# EAGLE design 02_OR (EAGLE 7.5.0)
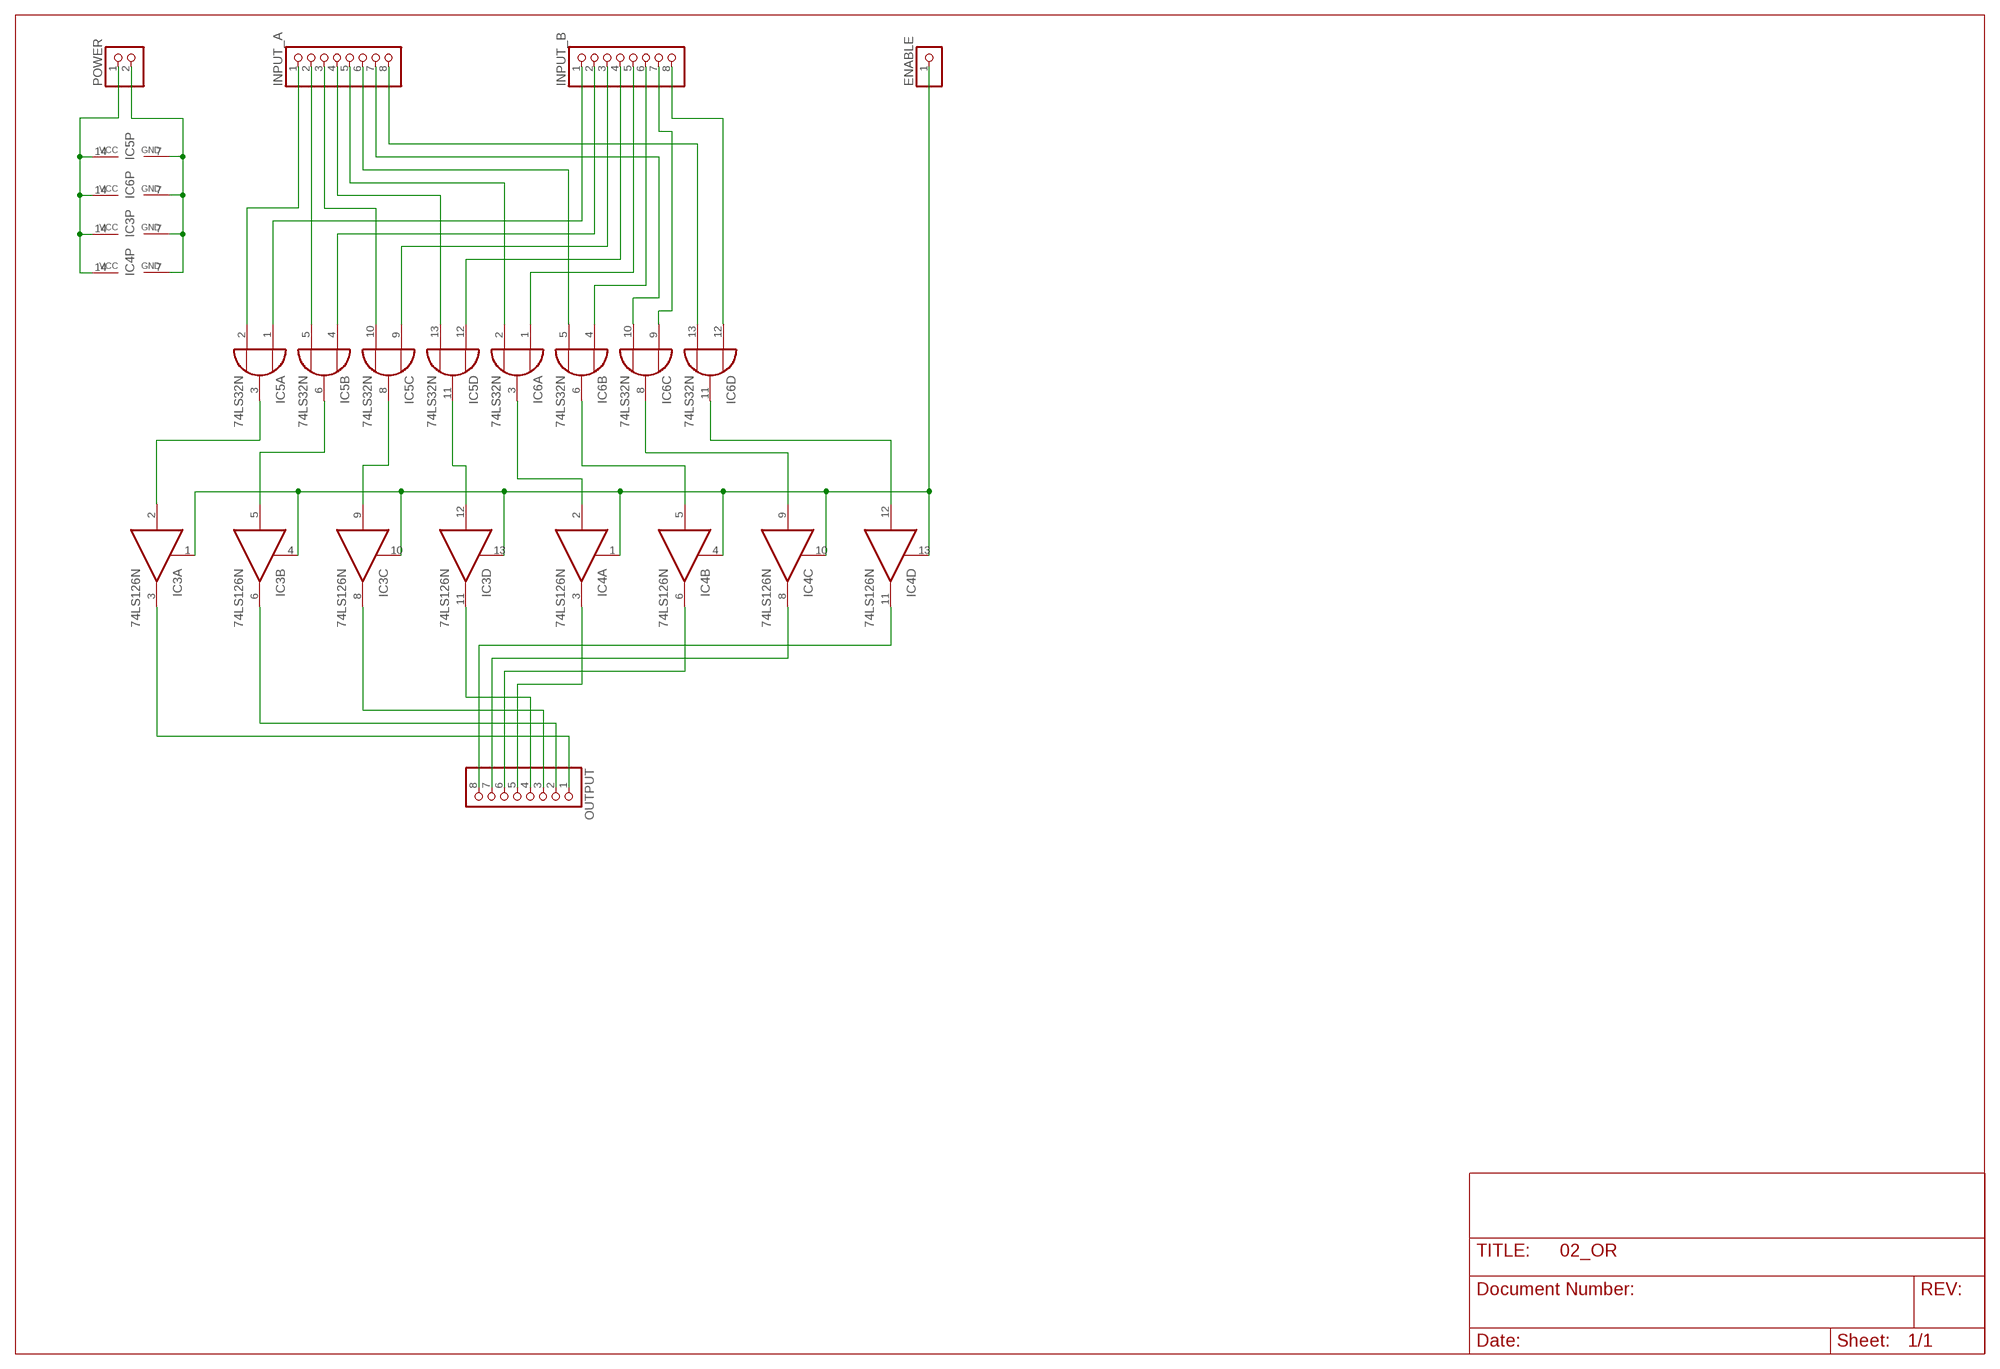
[diagram p0: schematic, sheet 1]

## Parts
ENABLE  PINHD-1X1  [1X01]
IC3  74LS126N  [DIL14]
IC4  74LS126N  [DIL14]
IC5  74LS32N  [DIL14]
IC6  74LS32N  [DIL14]
INPUT_A  PINHD-1X8  [1X08]
INPUT_B  PINHD-1X8  [1X08]
OUTPUT  PINHD-1X8  [1X08]
POWER  PINHD-1X2  [1X02]

## Nets
GND: IC5.7(P:GND) IC6.7(P:GND) POWER.2
N$1: IC5.2(A:I1) INPUT_A.1
N$2: IC5.1(A:I0) INPUT_B.1
N$3: IC5.5(B:I1) INPUT_A.2
N$4: IC5.4(B:I0) INPUT_B.2
N$5: IC5.10(C:I1) INPUT_A.3
N$6: IC5.9(C:I0) INPUT_B.3
N$7: IC5.13(D:I1) INPUT_A.4
N$8: IC5.12(D:I0) INPUT_B.4
N$9: IC6.2(A:I1) INPUT_A.5
N$10: IC6.1(A:I0) INPUT_B.5
N$11: IC6.5(B:I1) INPUT_A.6
N$12: IC6.4(B:I0) INPUT_B.6
N$13: IC6.10(C:I1) INPUT_A.7
N$14: IC6.9(C:I0) INPUT_B.7
N$15: IC6.13(D:I1) INPUT_A.8
N$16: IC6.12(D:I0) INPUT_B.8
N$18: IC3.5(B:I) IC5.6(B:O)
N$19: IC3.9(C:I) IC5.8(C:O)
N$20: IC3.12(D:I) IC5.11(D:O)
N$21: IC4.2(A:I) IC6.3(A:O)
N$22: IC4.5(B:I) IC6.6(B:O)
N$23: IC4.9(C:I) IC6.8(C:O)
N$24: IC4.12(D:I) IC6.11(D:O)
N$25: IC3.3(A:O) OUTPUT.1
N$26: IC3.6(B:O) OUTPUT.2
N$27: IC3.8(C:O) OUTPUT.3
N$28: IC3.11(D:O) OUTPUT.4
N$29: IC4.3(A:O) OUTPUT.5
N$30: IC4.6(B:O) OUTPUT.6
N$31: IC4.8(C:O) OUTPUT.7
N$32: IC4.11(D:O) OUTPUT.8
N$33: ENABLE.1 IC3.1(A:OE) IC3.4(B:OE) IC3.10(C:OE) IC3.13(D:OE) IC4.1(A:OE) IC4.4(B:OE) IC4.10(C:OE) IC4.13(D:OE)
N$34: IC3.2(A:I) IC5.3(A:O)
VCC: IC3.14(P:VCC) IC4.14(P:VCC) IC5.14(P:VCC) IC6.14(P:VCC) POWER.1

## Power pins joined to a net without a drawn wire
GND: IC3.7(P:GND) IC4.7(P:GND)

## Library data of the parts
ENABLE = pinhead:PINHD-1X1: PIN HEADER
IC3 IC4 = 74xx-eu:74*126: Quad bus BUFFER, 3-state
IC5 IC6 = 74xx-eu:74*32: Quad 2-input OR gate
INPUT_A INPUT_B OUTPUT = pinhead:PINHD-1X8: PIN HEADER
POWER = pinhead:PINHD-1X2: PIN HEADER

## Board
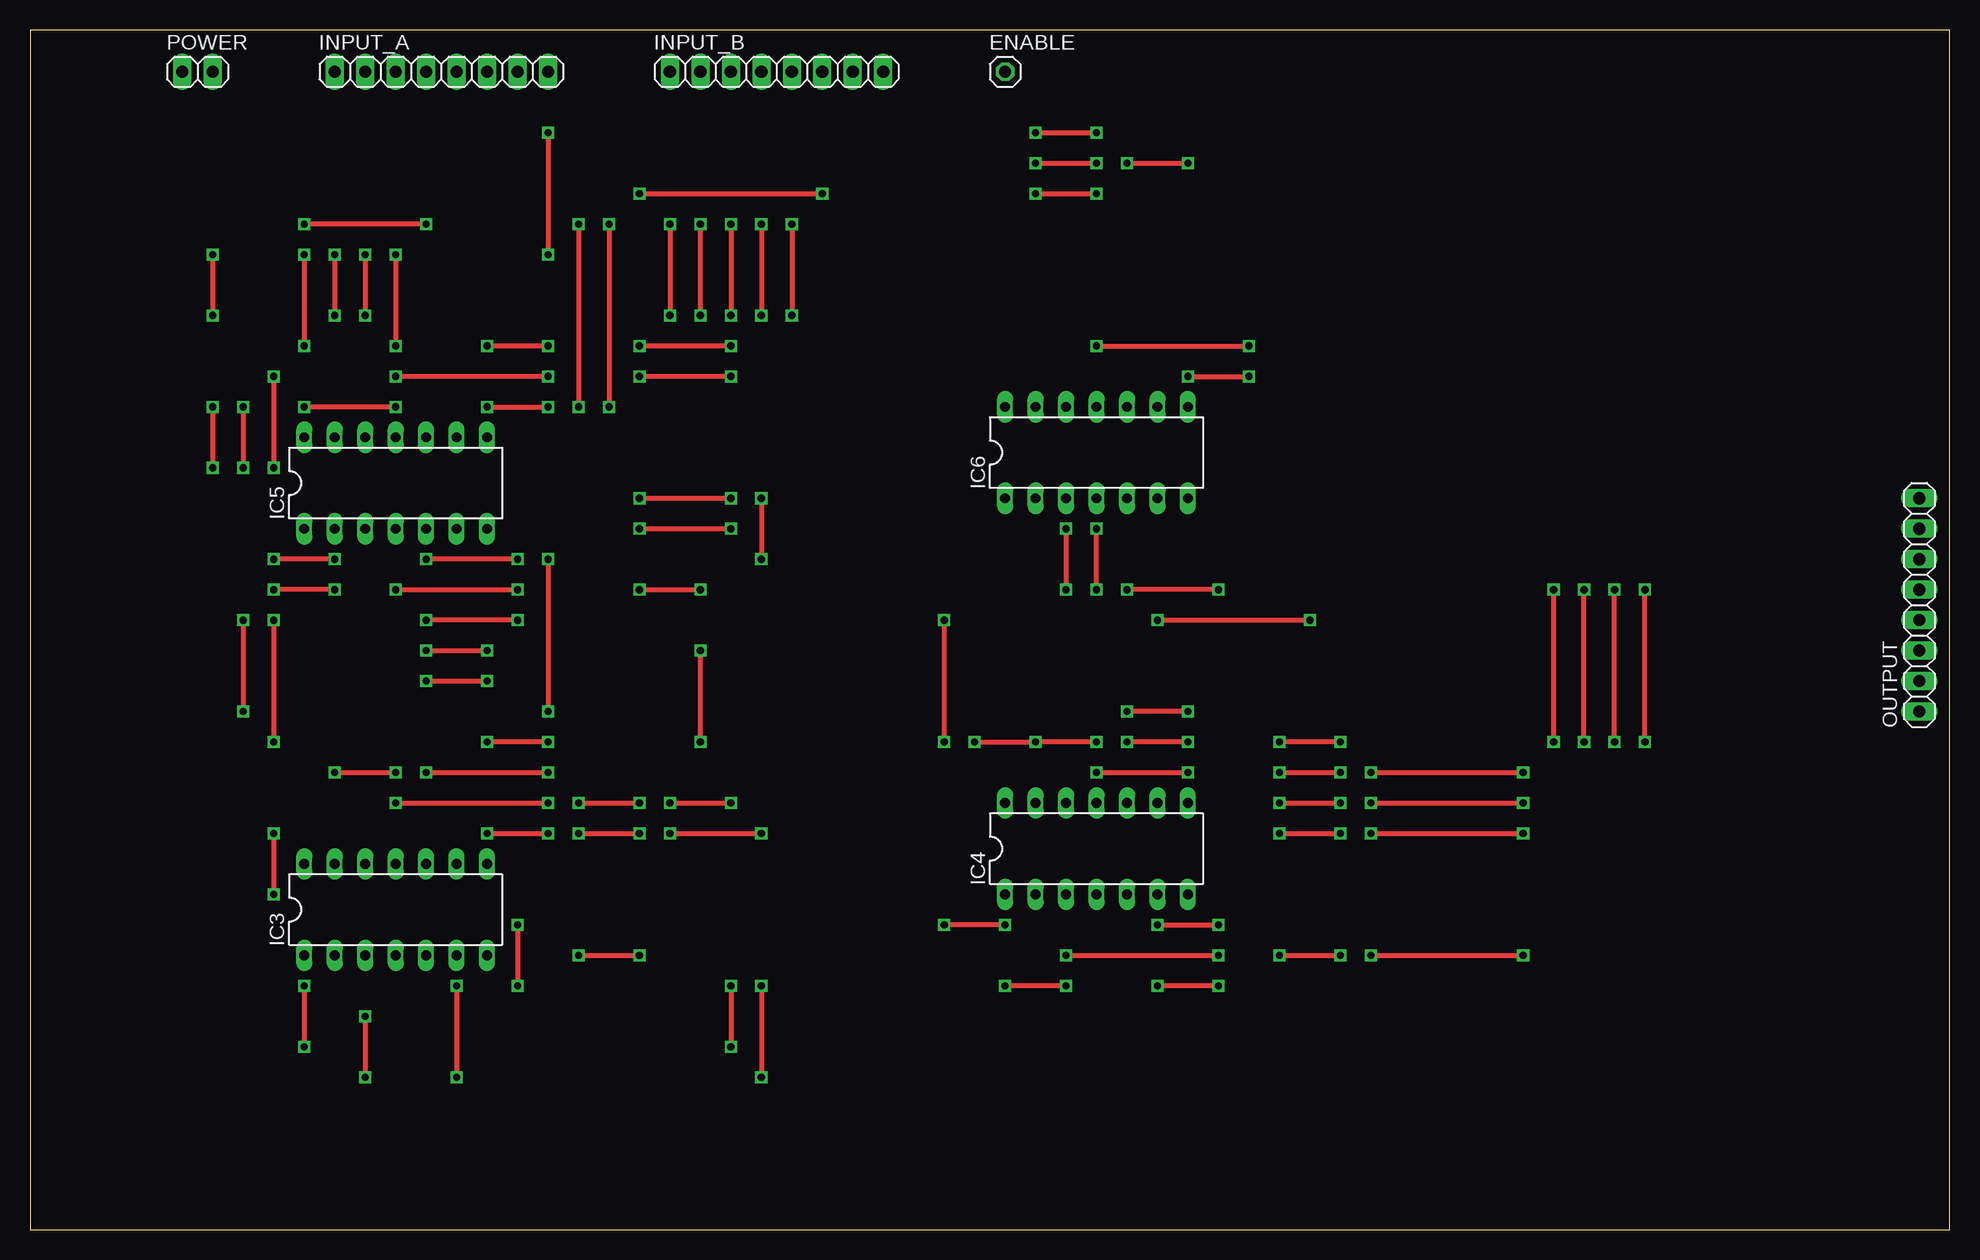
[diagram p1: board, top side]
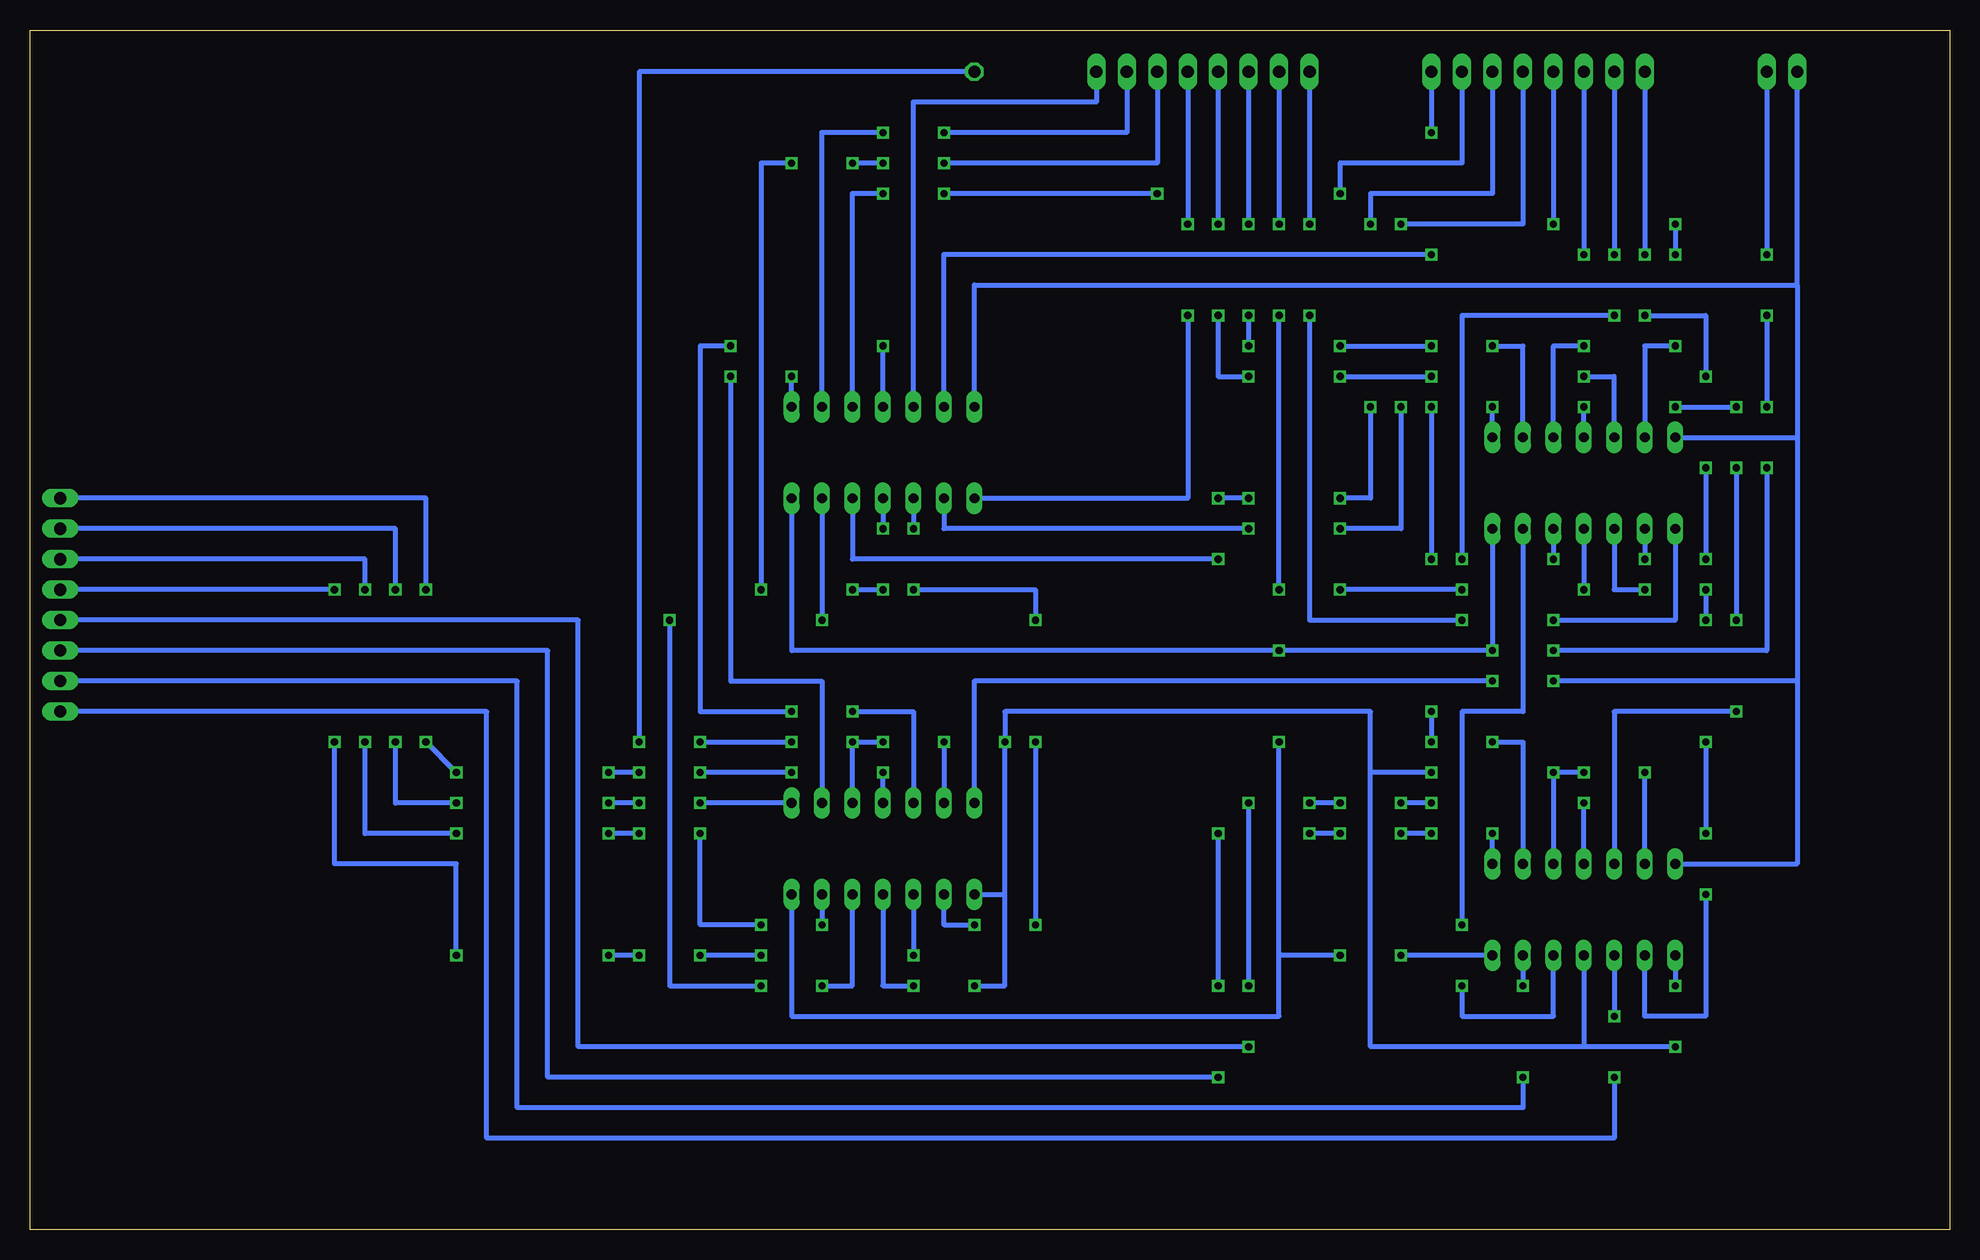
[diagram p2: board, bottom side, seen from below]

Size 160 x 100 mm. Coordinates in mm from the lower left corner, seen from the top.
Outline: 0,0 160,0 160,100 0,100 0,0
Copper layers (1*16): Top 0.035mm / dielectric 1.5mm / Bottom 0.035mm
Design rules "default": minimum track width 10mil, minimum drill 24mil, track to track 8mil, track to pad 8mil, pad to pad 8mil, via to via 8mil, smd to smd 8mil, copper to edge 40mil, drill to drill 8mil, minimum pad ring 10mil, minimum via ring 8mil, stop-mask expansion 4mil, vias tented up to drill 0mil, thermal gap 10mil

### Footprints (pad centres in the part's own frame; a part is rotated, then mirrored left to right if it is on the bottom)
1X01 = drill 1.016 octagon: 1 0,0
DIL14 = drill 0.813 long: 1 -7.62,-3.81; 2 -5.08,-3.81; 3 -2.54,-3.81; 4 0,-3.81; 5 2.54,-3.81; 6 5.08,-3.81; 7 7.62,-3.81; 8 7.62,3.81; 9 5.08,3.81; 10 2.54,3.81; 11 0,3.81; 12 -2.54,3.81; 13 -5.08,3.81; 14 -7.62,3.81
1X08 = drill 1.016 long: 1 -8.89,0; 2 -6.35,0; 3 -3.81,0; 4 -1.27,0; 5 1.27,0; 6 3.81,0; 7 6.35,0; 8 8.89,0
1X02 = drill 1.016 long: 1 -1.27,0; 2 1.27,0

### Placement (x,y rotation side)
ENABLE  81.28,96.52 0 top
IC3  30.48,26.67 0 top
IC4  88.9,31.75 0 top
IC5  30.48,62.23 0 top
IC6  88.9,64.77 0 top
INPUT_A  34.29,96.52 0 top
INPUT_B  62.23,96.52 0 top
OUTPUT  157.48,52.07 90 top
POWER  13.97,96.52 0 top

### Tracks (layer width: path | path; a pad name or v marks a point on that pad's centre or on a via)
GND  (via drill 0.6)
  Top 0.406: v15.24,81.28 v15.24,76.2 | v15.24,68.58 v15.24,63.5 | v55.88,40.64 v55.88,48.26 | v33.02,48.26 v38.1,48.26 | v45.72,22.86 v50.8,22.86
  Bottom 0.406: POWER.2 v15.24,81.28 | v15.24,76.2 v15.24,68.58 | v15.24,63.5 15.24,48.26 v33.02,48.26 | 55.88,22.86 55.88,17.78 96.52,17.78 IC4.7 | 55.88,22.86 v55.88,40.64 | v50.8,22.86 55.88,22.86 | IC5.7 v38.1,48.26 v55.88,48.26 96.52,48.26 IC6.7 | IC3.7 v45.72,22.86
N$1  (via drill 0.6)
  Top 0.406: v25.4,81.28 v25.4,76.2 | v20.32,71.12 v20.32,63.5 | v25.4,55.88 v20.32,55.88
  Bottom 0.406: INPUT_A.1 v25.4,81.28 | v25.4,76.2 20.32,76.2 v20.32,71.12 | v20.32,63.5 v20.32,55.88 | IC5.2 v25.4,55.88
N$2  (via drill 0.6)
  Top 0.406: v53.34,83.82 v53.34,76.2 | v40.64,50.8 v33.02,50.8
  Bottom 0.406: INPUT_B.1 v53.34,83.82 | v53.34,76.2 53.34,50.8 v40.64,50.8 | v33.02,50.8 22.86,50.8 IC5.1
N$3  (via drill 0.6)
  Top 0.406: v27.94,81.28 v27.94,76.2 | v40.64,55.88 v33.02,55.88
  Bottom 0.406: INPUT_A.2 v27.94,81.28 | v40.64,55.88 40.64,76.2 v27.94,76.2 | IC5.5 v33.02,55.88
N$4  (via drill 0.6)
  Top 0.406: v30.48,53.34 v40.64,53.34 | v50.8,53.34 v55.88,53.34 | v55.88,76.2 v55.88,83.82
  Bottom 0.406: INPUT_B.2 v55.88,83.82 | v40.64,53.34 v50.8,53.34 | v55.88,53.34 v55.88,76.2 | IC5.4 v30.48,53.34
N$5  (via drill 0.6)
  Top 0.406: v30.48,81.28 v30.48,73.66
  Bottom 0.406: INPUT_A.3 v30.48,81.28 | v30.48,73.66 33.02,73.66 IC5.10
N$6  (via drill 0.6)
  Top 0.406: v58.42,83.82 v58.42,76.2 | v58.42,73.66 v50.8,73.66 | v43.18,73.66 v38.1,73.66
  Bottom 0.406: INPUT_B.3 v58.42,83.82 | v58.42,76.2 v58.42,73.66 | v50.8,73.66 v43.18,73.66 | v38.1,73.66 35.56,73.66 IC5.9
N$7  (via drill 0.6)
  Top 0.406: v33.02,83.82 v22.86,83.82 | v22.86,81.28 v22.86,73.66
  Bottom 0.406: INPUT_A.4 v33.02,83.82 | v22.86,83.82 v22.86,81.28 | v22.86,73.66 25.4,73.66 IC5.13
N$8  (via drill 0.6)
  Top 0.406: v60.96,83.82 v60.96,76.2 | v58.42,71.12 v50.8,71.12 | v43.18,71.12 v30.48,71.12
  Bottom 0.406: INPUT_B.4 v60.96,83.82 | v60.96,76.2 60.96,71.12 v58.42,71.12 | v50.8,71.12 v43.18,71.12 | v30.48,71.12 27.94,71.12 IC5.12
N$9  (via drill 0.6)
  Top 0.406: v45.72,83.82 v45.72,68.58 | v50.8,58.42 v58.42,58.42
  Bottom 0.406: INPUT_A.5 35.56,83.82 v45.72,83.82 | v45.72,68.58 45.72,58.42 v50.8,58.42 | v58.42,58.42 83.82,58.42 IC6.2
N$10  (via drill 0.6)
  Top 0.406: v63.5,83.82 v63.5,76.2
  Bottom 0.406: INPUT_B.5 v63.5,83.82 | v63.5,76.2 63.5,60.96 IC6.1
N$11  (via drill 0.6)
  Top 0.406: v48.26,83.82 v48.26,68.58 | v50.8,60.96 v58.42,60.96 | v60.96,60.96 v60.96,55.88
  Bottom 0.406: INPUT_A.6 38.1,86.36 48.26,86.36 v48.26,83.82 | v48.26,68.58 48.26,60.96 v50.8,60.96 | v58.42,60.96 v60.96,60.96 | v60.96,55.88 91.44,55.88 IC6.5
N$12  (via drill 0.6)
  Top 0.406: v83.82,88.9 v88.9,88.9 | v91.44,88.9 v96.52,88.9 | v88.9,53.34 v88.9,58.42 | v99.06,53.34 v91.44,53.34
  Bottom 0.406: INPUT_B.6 66.04,88.9 v83.82,88.9 | v88.9,88.9 v91.44,88.9 | v96.52,88.9 99.06,88.9 v99.06,53.34 | v91.44,53.34 v88.9,53.34 | IC6.4 v88.9,58.42
N$13  (via drill 0.6)
  Top 0.406: v50.8,86.36 v66.04,86.36 | v83.82,86.36 v88.9,86.36
  Bottom 0.406: INPUT_A.7 40.64,88.9 50.8,88.9 v50.8,86.36 | v66.04,86.36 v83.82,86.36 | v88.9,86.36 91.44,86.36 IC6.10
N$14  (via drill 0.6)
  Top 0.406: v83.82,91.44 v88.9,91.44
  Bottom 0.406: INPUT_B.7 68.58,91.44 v83.82,91.44 | v88.9,91.44 93.98,91.44 IC6.9
N$15  (via drill 0.6)
  Top 0.406: v43.18,91.44 v43.18,81.28
  Bottom 0.406: INPUT_A.8 v43.18,91.44 | v43.18,81.28 83.82,81.28 IC6.13
N$16
  Bottom 0.406: INPUT_B.8 71.12,93.98 86.36,93.98 IC6.12
N$18  (via drill 0.6)
  Top 0.406: v40.64,25.4 v40.64,20.32
  Bottom 0.406: v40.64,25.4 40.64,43.18 35.56,43.18 IC5.6 | v40.64,20.32 40.64,17.78 33.02,17.78 IC3.5
N$19  (via drill 0.6)
  Top 0.406: v38.1,68.58 v43.18,68.58 | v43.18,55.88 v43.18,43.18 | v43.18,40.64 v38.1,40.64
  Bottom 0.406: v43.18,68.58 v43.18,55.88 | v43.18,43.18 v43.18,40.64 | v38.1,40.64 35.56,40.64 IC3.9 | IC5.8 v38.1,68.58
N$20  (via drill 0.6)
  Top 0.406: v30.48,68.58 v22.86,68.58 | v17.78,68.58 v17.78,63.5 | v17.78,50.8 v17.78,43.18
  Bottom 0.406: v22.86,68.58 v17.78,68.58 | v17.78,63.5 v17.78,50.8 | v17.78,43.18 27.94,43.18 IC3.12 | IC5.11 v30.48,68.58
N$21  (via drill 0.6)
  Top 0.406: v86.36,58.42 v86.36,53.34 | v76.2,50.8 v76.2,40.64 | v81.28,25.4 v76.2,25.4
  Bottom 0.406: v86.36,53.34 76.2,53.34 v76.2,50.8 | v76.2,40.64 v76.2,25.4 | IC4.2 83.82,25.4 v81.28,25.4 | IC6.3 v86.36,58.42
N$22  (via drill 0.6)
  Top 0.406: v93.98,50.8 v106.68,50.8 | v99.06,20.32 v93.98,20.32
  Bottom 0.406: v106.68,50.8 106.68,20.32 v99.06,20.32 | v93.98,20.32 91.44,20.32 IC4.5 | IC6.6 v93.98,50.8
N$23  (via drill 0.6)
  Top 0.406: v96.52,71.12 v101.6,71.12
  Bottom 0.406: v101.6,71.12 101.6,45.72 93.98,45.72 IC4.9 | IC6.8 v96.52,71.12
N$24  (via drill 0.6)
  Top 0.406: v88.9,73.66 v101.6,73.66 | v96.52,43.18 v91.44,43.18
  Bottom 0.406: v101.6,73.66 104.14,73.66 104.14,43.18 v96.52,43.18 | v91.44,43.18 86.36,43.18 IC4.12 | IC6.11 v88.9,73.66
N$25  (via drill 0.6)
  Top 0.406: v27.94,17.78 v27.94,12.7
  Bottom 0.406: IC3.3 v27.94,17.78 | v27.94,12.7 27.94,7.62 121.92,7.62 121.92,43.18 OUTPUT.1
N$26  (via drill 0.6)
  Top 0.406: v35.56,20.32 v35.56,12.7
  Bottom 0.406: IC3.6 v35.56,20.32 | v35.56,12.7 35.56,10.16 119.38,10.16 119.38,45.72 OUTPUT.2
N$27  (via drill 0.6)
  Top 0.406: v38.1,33.02 v43.18,33.02 | v45.72,33.02 v50.8,33.02 | v53.34,33.02 v60.96,33.02 | v60.96,20.32 v60.96,12.7
  Bottom 0.406: IC3.8 v38.1,33.02 | v43.18,33.02 v45.72,33.02 | v50.8,33.02 v53.34,33.02 | v60.96,33.02 v60.96,20.32 | v60.96,12.7 116.84,12.7 116.84,48.26 OUTPUT.3
N$28  (via drill 0.6)
  Top 0.406: v30.48,35.56 v43.18,35.56 | v45.72,35.56 v50.8,35.56 | v53.34,35.56 v58.42,35.56 | v58.42,20.32 v58.42,15.24
  Bottom 0.406: IC3.11 v30.48,35.56 | v43.18,35.56 v45.72,35.56 | v50.8,35.56 v53.34,35.56 | v58.42,35.56 v58.42,20.32 | v58.42,15.24 114.3,15.24 114.3,50.8 OUTPUT.4
N$29  (via drill 0.6)
  Top 0.406: v86.36,22.86 v99.06,22.86 | v104.14,22.86 v109.22,22.86 | v111.76,22.86 v124.46,22.86 | v134.62,40.64 v134.62,53.34
  Bottom 0.406: IC4.3 v86.36,22.86 | v99.06,22.86 v104.14,22.86 | v109.22,22.86 v111.76,22.86 | v124.46,22.86 124.46,30.48 134.62,30.48 v134.62,40.64 | v134.62,53.34 OUTPUT.5
N$30  (via drill 0.6)
  Top 0.406: v93.98,25.4 v99.06,25.4 | v104.14,33.02 v109.22,33.02 | v111.76,33.02 v124.46,33.02 | v132.08,40.64 v132.08,53.34
  Bottom 0.406: IC4.6 v93.98,25.4 | v99.06,25.4 104.14,25.4 v104.14,33.02 | v109.22,33.02 v111.76,33.02 | v124.46,33.02 132.08,33.02 v132.08,40.64 | v132.08,53.34 132.08,55.88 OUTPUT.6
N$31  (via drill 0.6)
  Top 0.406: v129.54,40.64 v129.54,53.34 | v104.14,35.56 v109.22,35.56 | v111.76,35.56 v124.46,35.56
  Bottom 0.406: IC4.8 v104.14,35.56 | v124.46,35.56 129.54,35.56 v129.54,40.64 | v129.54,53.34 129.54,58.42 OUTPUT.7 | v109.22,35.56 v111.76,35.56
N$32  (via drill 0.6)
  Top 0.406: v88.9,38.1 v96.52,38.1 | v127,40.64 v127,53.34 | v104.14,38.1 v109.22,38.1 | v111.76,38.1 v124.46,38.1
  Bottom 0.406: IC4.11 v88.9,38.1 | v96.52,38.1 v104.14,38.1 | v124.46,38.1 v127,40.64 | v127,53.34 127,60.96 OUTPUT.8 | v109.22,38.1 v111.76,38.1
N$33  (via drill 0.6)
  Top 0.406: v109.22,40.64 v104.14,40.64 | v96.52,40.64 v91.44,40.64 | v88.9,40.64 v83.82,40.64 v78.74,40.64 | v25.4,38.1 v30.48,38.1 | v33.02,38.1 v43.18,38.1 | v22.86,20.32 v22.86,15.24 | v86.36,20.32 v81.28,20.32
  Bottom 0.406: ENABLE.1 109.22,96.52 v109.22,40.64 | v104.14,40.64 v96.52,40.64 | v88.9,40.64 v91.44,40.64 IC4.10 | v83.82,40.64 IC4.13 | IC3.13 v25.4,38.1 | v30.48,38.1 v33.02,38.1 IC3.10 | v43.18,38.1 48.26,38.1 | 48.26,38.1 48.26,43.18 78.74,43.18 v78.74,40.64 78.74,27.94 | IC3.1 v22.86,20.32 | v22.86,15.24 30.48,15.24 | 30.48,15.24 48.26,15.24 48.26,38.1 | IC3.4 30.48,15.24 | IC4.1 78.74,27.94 | IC4.4 88.9,20.32 v86.36,20.32 | v81.28,20.32 78.74,20.32 78.74,27.94
N$34  (via drill 0.6)
  Top 0.406: v25.4,53.34 v20.32,53.34 | v20.32,50.8 v20.32,40.64 | v20.32,33.02 v20.32,27.94
  Bottom 0.406: IC5.3 27.94,53.34 v25.4,53.34 | v20.32,53.34 v20.32,50.8 | v20.32,40.64 v20.32,33.02 | v20.32,27.94 20.32,17.78 25.4,17.78 IC3.2
VCC  (via drill 0.6)
  Top 0.406: v33.02,45.72 v38.1,45.72
  Bottom 0.406: 12.7,78.74 12.7,66.04 | 12.7,66.04 12.7,45.72 | 12.7,45.72 12.7,30.48 IC3.14 | 12.7,78.74 81.28,78.74 IC6.14 | 12.7,45.72 v33.02,45.72 | v38.1,45.72 81.28,45.72 IC4.14 | 12.7,78.74 POWER.1 | IC5.14 12.7,66.04